# EAGLE schematic smart well (EAGLE 7.2.0)
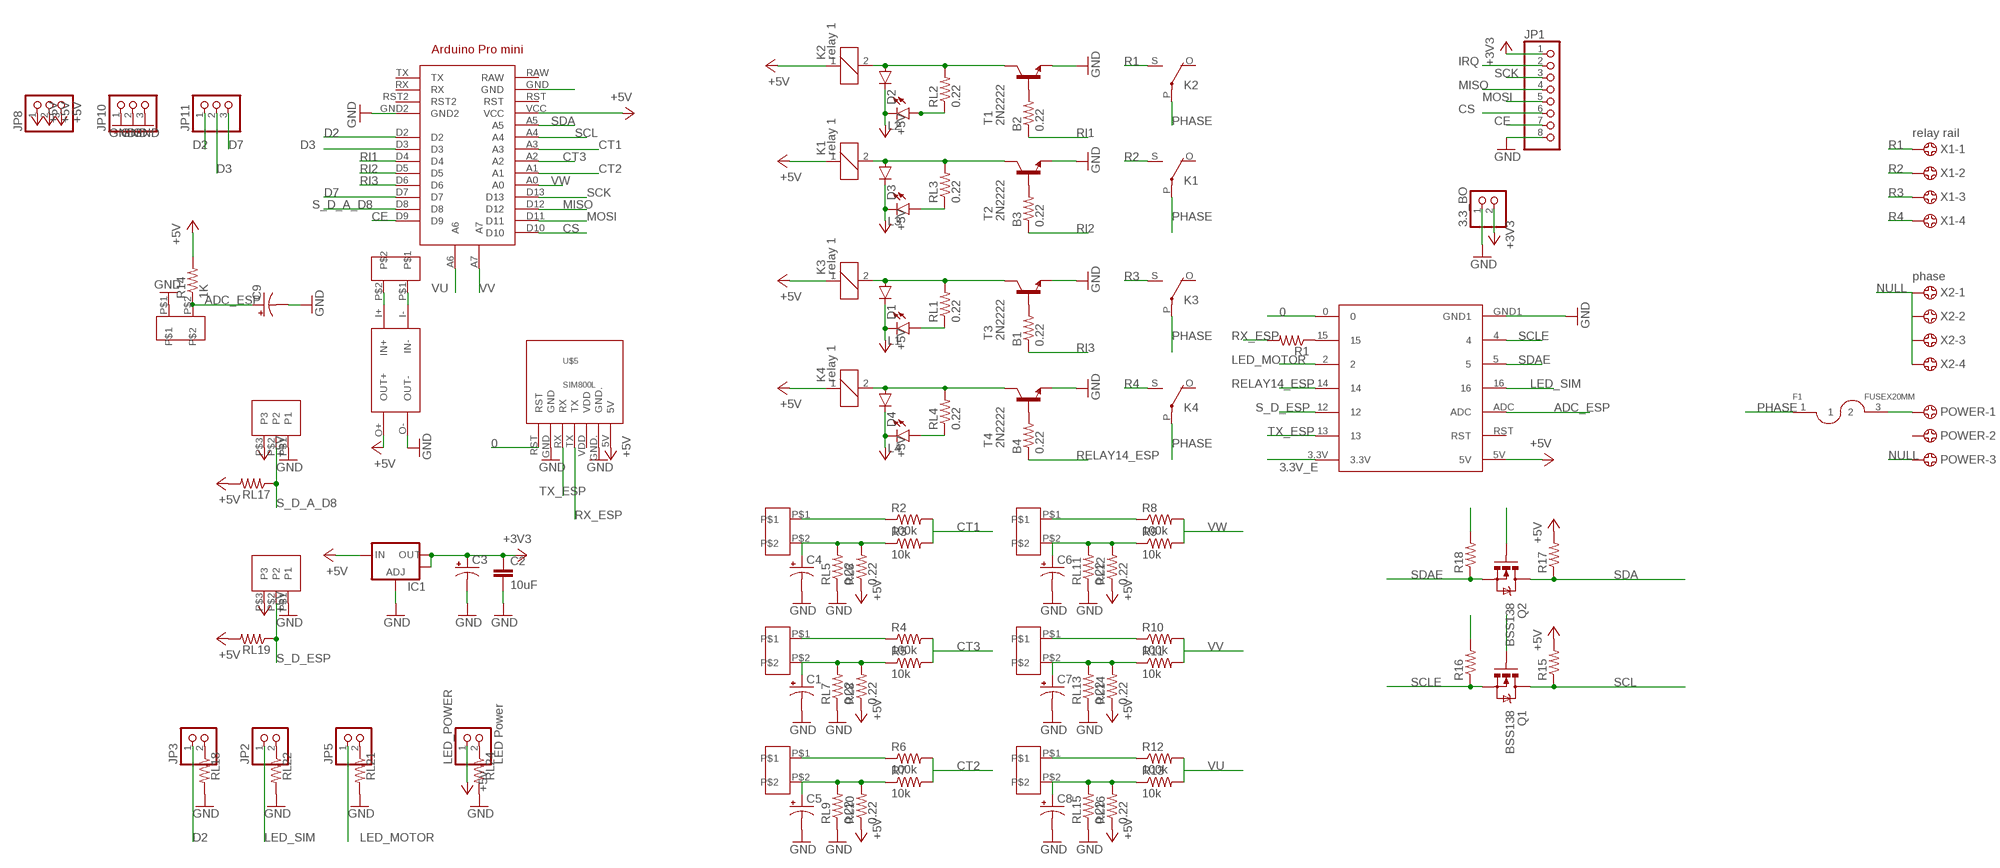
[diagram p0: schematic, sheet 1]

## Parts
3.3_BO  PINHD-1X2  [1X02]
B1  0.22  0.22OHM-1/4W-1%(0805)  [0805]
B2  0.22  0.22OHM-1/4W-1%(0805)  [0805]
B3  0.22  0.22OHM-1/4W-1%(0805)  [0805]
B4  0.22  0.22OHM-1/4W-1%(0805)  [0805]
C1  100UF-25V-20%(PTH)  [CPOL-RADIAL-100UF-25V]
C2  10uF  10UF50V20%(1210)  [1210]
C3  100UF-25V-20%(PTH)  [CPOL-RADIAL-100UF-25V]
C4  100UF-25V-20%(PTH)  [CPOL-RADIAL-100UF-25V]
C5  100UF-25V-20%(PTH)  [CPOL-RADIAL-100UF-25V]
C6  100UF-25V-20%(PTH)  [CPOL-RADIAL-100UF-25V]
C7  100UF-25V-20%(PTH)  [CPOL-RADIAL-100UF-25V]
C8  100UF-25V-20%(PTH)  [CPOL-RADIAL-100UF-25V]
C9  10UF-25V-20%(PTH)KIT  [CPOL-RADIAL-10UF-25V-KIT]
CT1  ct1  PIN_LOCK_1X2  [PIN_LOCK1X2]
CT2  ct1  PIN_LOCK_1X2  [PIN_LOCK1X2]
CT3  ct1  PIN_LOCK_1X2  [PIN_LOCK1X2]
CT4  ct1  PIN_LOCK_1X2  [PIN_LOCK1X2]
CT5  ct1  PIN_LOCK_1X2  [PIN_LOCK1X2]
CT6  ct1  PIN_LOCK_1X2  [PIN_LOCK1X2]
D1  DIODEKIT2  [DIODE-1N4001-KIT]
D2  DIODEKIT2  [DIODE-1N4001-KIT]
D3  DIODEKIT2  [DIODE-1N4001-KIT]
D4  DIODEKIT2  [DIODE-1N4001-KIT]
F1  FUSEX20MM  [FUSE_5MM]
IC1  V_REG_LM1117SOT223  [SOT223]
JP1  PINHD-1X8  [1X08]
JP2  PINHD-1X2  [1X02]
JP3  PINHD-1X2  [1X02]
JP5  PINHD-1X2  [1X02]
JP8  PINHD-1X3  [1X03]
JP10  PINHD-1X3  [1X03]
JP11  PINHD-1X3  [1X03]
K1  relay 1  G5LE  [G5LE]
K2  relay 1  G5LE  [G5LE]
K3  relay 1  G5LE  [G5LE]
K4  relay 1  G5LE  [G5LE]
L1  LED3MM  [LED3MM]
L2  LED3MM  [LED3MM]
L3  LED3MM  [LED3MM]
L4  LED3MM  [LED3MM]
LED_POWER  LED Power  PINHD-1X2  [1X02]
POWER  5202-03-N-02  [5202-03-N-02]
Q1  BSS138  MOSFET-NCHANNELBSS138  [SOT23-3]
Q2  BSS138  MOSFET-NCHANNELBSS138  [SOT23-3]
R1  0.3OHM-1/8W-1%(0805)  [0805]
R2  100k  10OHM-1/4W-5%(PTH)VERT  [AXIAL-0.1]
R3  10k  10OHM-1/4W-5%(PTH)VERT  [AXIAL-0.1]
R4  100k  10OHM-1/4W-5%(PTH)VERT  [AXIAL-0.1]
R5  10k  10OHM-1/4W-5%(PTH)VERT  [AXIAL-0.1]
R6  100k  10OHM-1/4W-5%(PTH)VERT  [AXIAL-0.1]
R7  10k  10OHM-1/4W-5%(PTH)VERT  [AXIAL-0.1]
R8  100k  10OHM-1/4W-5%(PTH)VERT  [AXIAL-0.1]
R9  10k  10OHM-1/4W-5%(PTH)VERT  [AXIAL-0.1]
R10  100k  10OHM-1/4W-5%(PTH)VERT  [AXIAL-0.1]
R11  10k  10OHM-1/4W-5%(PTH)VERT  [AXIAL-0.1]
R12  100k  10OHM-1/4W-5%(PTH)VERT  [AXIAL-0.1]
R13  10k  10OHM-1/4W-5%(PTH)VERT  [AXIAL-0.1]
R14  1K  1KOHM-1/4W-1%(PTH)VERT  [AXIAL-0.1]
R15  0.22OHM-1/4W-1%(0805)  [0805]
R16  0.22OHM-1/4W-1%(0805)  [0805]
R17  0.22OHM-1/4W-1%(0805)  [0805]
R18  0.22OHM-1/4W-1%(0805)  [0805]
RL1  0.22  0.22OHM-1/4W-1%(0805)  [0805]
RL2  0.22  0.22OHM-1/4W-1%(0805)  [0805]
RL3  0.22  0.22OHM-1/4W-1%(0805)  [0805]
RL4  0.22  0.22OHM-1/4W-1%(0805)  [0805]
RL5  0.22  0.22OHM-1/4W-1%(0805)  [0805]
RL6  0.22  0.22OHM-1/4W-1%(0805)  [0805]
RL7  0.22  0.22OHM-1/4W-1%(0805)  [0805]
RL8  0.22  0.22OHM-1/4W-1%(0805)  [0805]
RL9  0.22  0.22OHM-1/4W-1%(0805)  [0805]
RL10  0.22  0.22OHM-1/4W-1%(0805)  [0805]
RL11  0.22  0.22OHM-1/4W-1%(0805)  [0805]
RL12  0.22  0.22OHM-1/4W-1%(0805)  [0805]
RL13  0.22  0.22OHM-1/4W-1%(0805)  [0805]
RL14  0.22  0.22OHM-1/4W-1%(0805)  [0805]
RL15  0.22  0.22OHM-1/4W-1%(0805)  [0805]
RL16  0.22  0.22OHM-1/4W-1%(0805)  [0805]
RL17  0.22OHM-1/4W-1%(0805)  [0805]
RL18  0.22OHM-1/4W-1%(0805)  [0805]
RL19  0.22OHM-1/4W-1%(0805)  [0805]
RL21  0.22OHM-1/4W-1%(0805)  [0805]
RL22  0.22OHM-1/4W-1%(0805)  [0805]
RL24  0.22OHM-1/4W-1%(0805)  [0805]
T1  2N2222  [TO92-EBC-OVAL]
T2  2N2222  [TO92-EBC-OVAL]
T3  2N2222  [TO92-EBC-OVAL]
T4  2N2222  [TO92-EBC-OVAL]
U$2  PIN_LOCK_1X3  [PIN_LOCK1X3]
U$3  ESP12F_SHEILD10PIN  [ESP12F_SHEILD10PIN]
U$5  SIM800L  [SIM800L]
U$6  DC-DC  [DC-DC]
U$7  ARDUINO_DIP  [ARDUINO_DIP]
U$8  PIN_LOCK_1X3  [PIN_LOCK1X3]
U$9  PIN_LOCK_1X2  [PIN_LOCK1X2]
U$11  PIN_LOCK_1X2  [PIN_LOCK1X2]
X1  relay rail  5202-04-N-02  [5202-04-N-02]
X2  phase  5202-04-N-02  [5202-04-N-02]

## Nets
0: U$3.0 U$5.RST
3.3V_E: Q1.1(G) Q2.1(G) R16.2 R18.2 U$3.3.3V
+3V3: 3.3_BO.2 C2.1 C3.1(+) IC1.2(OUT) IC1.4(OUT) JP1.1
+5V: D1.C D2.C D3.C D4.C IC1.3(IN) JP8.1 JP8.2 JP8.3 K1.1 K2.1 K3.1 K4.1 L1.K(C) L2.K(C) L3.K(C) L4.K(C) LED_POWER.1 R14.P$2 R15.2 R17.2 RL6.1 RL8.1 RL10.1 RL12.1 RL14.1 RL16.1 RL17.2 RL19.2 U$2.P$3(P3) U$3.5V U$5.5V U$6.O+(OUT+) U$7.VCC U$8.P$3(P3)
ADC_ESP: C9.1(+) R14.P$1 U$3.ADC U$11.P$2
CE: JP1.7 U$7.D9
CS: JP1.6 U$7.D10
CT1: R2.P$2 R3.P$2 U$7.A3
CT2: R6.P$2 R7.P$2 U$7.A1
CT3: R4.P$2 R5.P$2 U$7.A2
D2: JP3.1 JP11.1 U$7.D2
D3: JP11.2 U$7.D3
D7: JP11.3 U$7.D7
GND: 3.3_BO.1 C1.2(-) C2.2 C3.2(-) C4.2(-) C5.2(-) C6.2(-) C7.2(-) C8.2(-) C9.2(-) IC1.1(ADJ) JP1.8 JP10.1 JP10.2 JP10.3 RL5.1 RL7.1 RL9.1 RL11.1 RL13.1 RL15.1 RL18.2 RL21.2 RL22.2 RL24.2 T1.E T2.E T3.E T4.E U$2.P$1(P1) U$3.GND1 U$5.GND U$5.GND. U$6.O-(OUT-) U$7.GND2 U$8.P$1(P1) U$11.P$1
IRQ: JP1.2
LED_MOTOR: JP5.1 U$3.2
LED_SIM: JP2.1 U$3.16
MISO: JP1.4 U$7.D12
MOSI: JP1.5 U$7.D11
N$1: R1.1 U$3.15
N$2: U$7.GND
N$6: U$6.I+(IN+) U$9.P$2
N$7: D2.A K2.2 RL2.2 T1.C
N$8: D3.A K1.2 RL3.2 T2.C
N$9: B2.2 T1.B
N$10: B3.2 T2.B
N$11: L2.A RL2.1
N$12: L3.A RL3.1
N$13: F1.3 POWER.1
N$14: D1.A K3.2 RL1.2 T3.C
N$15: L1.A RL1.1
N$16: B1.2 T3.B
N$17: D4.A K4.2 RL4.2 T4.C
N$18: L4.A RL4.1
N$19: B4.2 T4.B
N$20: U$6.I-(IN-) U$9.P$1
N$21: CT2.P$1 R4.P$1
N$22: CT1.P$1 R2.P$1
N$23: C4.1(+) CT1.P$2 R3.P$1 RL5.2 RL6.2
N$24: C1.1(+) CT2.P$2 R5.P$1 RL7.2 RL8.2
N$25: CT3.P$1 R6.P$1
N$26: C5.1(+) CT3.P$2 R7.P$1 RL9.2 RL10.2
N$27: CT4.P$1 R8.P$1
N$28: C6.1(+) CT4.P$2 R9.P$1 RL11.2 RL12.2
N$29: CT5.P$1 R10.P$1
N$30: C7.1(+) CT5.P$2 R11.P$1 RL13.2 RL14.2
N$31: CT6.P$1 R12.P$1
N$32: C8.1(+) CT6.P$2 R13.P$1 RL15.2 RL16.2
N$35: JP5.2 RL21.1
N$36: JP2.2 RL22.1
N$38: LED_POWER.2 RL24.1
N$44: JP3.2 RL18.1
NULL: POWER.3 X2.1 X2.2 X2.3 X2.4
PHASE: F1.1 K1.P(2:P) K2.P(2:P) K3.P(2:P) K4.P(2:P)
R1: K2.S(2:S) X1.1
R2: K1.S(2:S) X1.2
R3: K3.S(2:S) X1.3
R4: K4.S(2:S) X1.4
RELAY14_ESP: B4.1 U$3.14
RI1: B2.1 U$7.D4
RI2: B3.1 U$7.D5
RI3: B1.1 U$7.D6
RX_ESP: R1.2 U$5.TX
S_D_A_D8: RL17.1 U$2.P$2(P2) U$7.D8
S_D_ESP: RL19.1 U$3.12 U$8.P$2(P2)
SCK: JP1.3 U$7.D13
SCL: Q1.3(D) R15.1 U$7.A4
SCLE: Q1.2(S) R16.1 U$3.4
SDA: Q2.3(D) R17.1 U$7.A5
SDAE: Q2.2(S) R18.1 U$3.5
TX_ESP: U$3.13 U$5.RX
VU: R12.P$2 R13.P$2 U$7.A6
VV: R10.P$2 R11.P$2 U$7.A7
VW: R8.P$2 R9.P$2 U$7.A0
Unconnected: K1.O(2:O) K2.O(2:O) K3.O(2:O) K4.O(2:O) POWER.2 U$3.RST U$5.VDD U$7.RAW U$7.RST U$7.RST2 U$7.RX U$7.TX

## Library data of the parts
3.3_BO JP2 JP3 JP5 LED_POWER = pinhead2:PINHD-1X2: PIN HEADER
B1-B4 RL1-RL16 = SparkFun-Resistors:0.22OHM-1/4W-1%(0805): RES-09883; PROD_ID: RES-09883
C1 C3-C8 = SparkFun-Capacitors:100UF-25V-20%(PTH): CAP-08439; PROD_ID: CAP-08439
C2 = SparkFun-Capacitors:10UF50V20%(1210): CAP-09824; PROD_ID: CAP-09824
C9 = SparkFun-Capacitors:10UF-25V-20%(PTH): CAP-08440; PROD_ID: CAP-08440
CT1-CT6 U$9 U$11 = ARDUINO_MODULE:PIN_LOCK_1X2
D1-D4 = SparkFun-DiscreteSemi:DIODE: Diode These are standard reverse protection diodes and small signal diodes. SMA package can handle up to about 1A. SOD-323 can handle about 200mA. What the SOD-323 package when ordering, there are some mfgs out there that are 5-pin packages.
F1 = SparkFun-Passives:FUSE
IC1 = SparkFun-PowerIC:V_REG_LM1117: Voltage Regulator LM1117 Standard adjustable voltage regulator but in SMD form. Spark Fun Electronics SKU : COM-00595; PROD_ID: VREG-08170
JP1 = pinhead2:PINHD-1X8: PIN HEADER
JP8 JP10 JP11 = pinhead2:PINHD-1X3: PIN HEADER
K1-K4 = relay:G5LE: RELAY 1 x switch, 10 A/120 V AC, 8 A/30 V DC, Omron; OC_FARNELL: unknown; OC_NEWARK: unknown
L1-L4 = SparkFun-LED:LED: LEDs Standard schematic elements and footprints for 5mm, 3mm, 1206, and 0603 sized LEDs. 5mm - Spark Fun Electronics SKU : COM-00529 (and others)
POWER = con-ebyelectro:5202-03-N-02: Barrier Blocks Sreies 5202 Source: http://www.ebyelectro.com/PDF/5202-XX-N-02.pdf; OC_FARNELL: unknown; OC_NEWARK: unknown
Q1 Q2 = SparkFun-DiscreteSemi:MOSFET-NCHANNEL: Common NMOSFET Parts MFG P/N Store ID Prod ID FDD8780 TRANS-09984 SI7820DN TRANS-11055 FDS6630A IC-08089 2N7002PW TRANS-11151 FQP30N06L COM-10213 TRANS-10060 BSS123LT1G TRANS-08345 BSS138 TRANS-00830 BS170 2N7000; PROD_ID: TRANS-00830; VALUE: 200mA/50V
R1 = SparkFun-Resistors:0.3OHM-1/8W-1%(0805): RES-11622; PROD_ID: RES-11622; VALUE: 0.3
R2-R13 = SparkFun-Resistors:10OHM-1/4W-5%(PTH): RES-10698; PROD_ID: RES-10698; VALUE: 10
R14 = SparkFun-Resistors:1KOHM-1/4W-1%(PTH): RES-12182; PROD_ID: RES-12182
R15-R18 RL17-RL19 RL21 RL22 RL24 = SparkFun-Resistors:0.22OHM-1/4W-1%(0805): RES-09883; PROD_ID: RES-09883; VALUE: 0.22
T1-T4 = adafruit:2N2222: NPN TRANSISTOR Big oval pads
U$2 U$8 = ARDUINO_MODULE:PIN_LOCK_1X3
U$3 = mysocket:ESP12F_SHEILD10PIN
U$5 = mysocket:SIM800L
U$6 = mysocket:DC-DC
U$7 = arduinopromini:ARDUINO_DIP
X1 X2 = con-ebyelectro:5202-04-N-02: Barrier Blocks Sreies 5202 Source: http://www.ebyelectro.com/PDF/5202-XX-N-02.pdf; OC_FARNELL: unknown; OC_NEWARK: unknown